# EAGLE design Combined board (EAGLE 9.5.0)
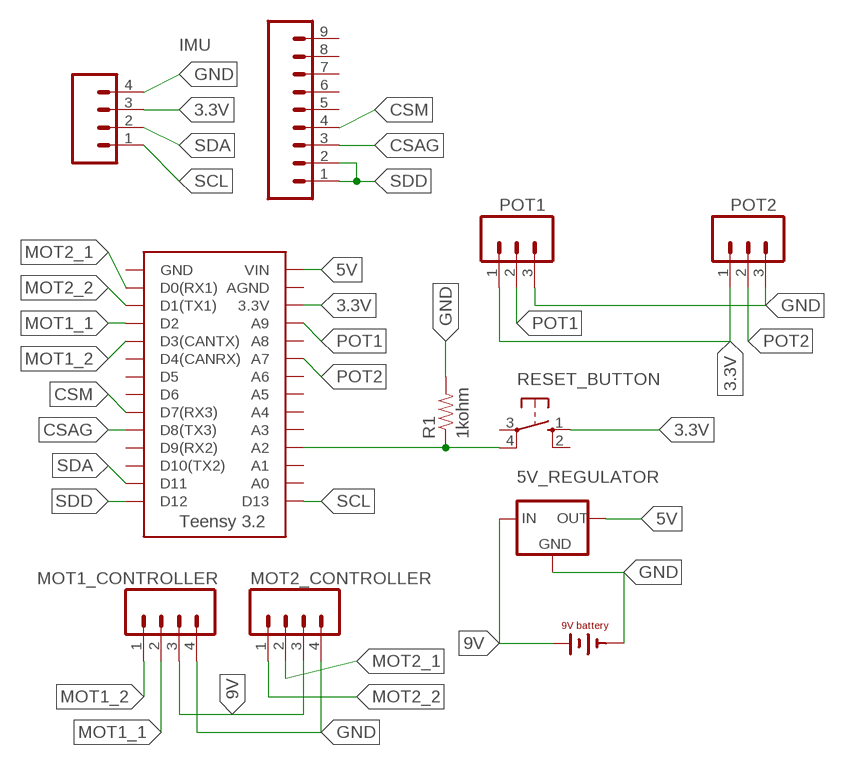
[diagram p0: schematic, sheet 1]

## Parts
5V_REGULATOR  OKI-78SR-5  [OKI-78SR]
G1  BAT9V  [AB9V]
IMU  M09  [1X09]
JP1  M04  [1X04]
MOT1_CONTROLLER  M04  [1X04]
MOT2_CONTROLLER  M04  [1X04]
POT1  M03  [1X03]
POT2  M03  [1X03]
R1  1kohm  RESISTORAXIAL-0.3  [AXIAL-0.3]
RESET_BUTTON  BTN_10-XX  [B3F-10XX]
U$2  TEENSY_3.2_SIMPLE  [TEENSY_3.2_SIMPLE]

## Nets
3.3V: JP1.3 POT1.1 POT2.1 RESET_BUTTON.1(S) U$2.3.3V
5V: 5V_REGULATOR.3(OUT) U$2.VIN
9V: 5V_REGULATOR.1(IN) G1.-(+) MOT1_CONTROLLER.3 MOT2_CONTROLLER.3
CSAG: IMU.3 U$2.D8(TX3)
CSM: IMU.4 U$2.D7(RX3)
GND: 5V_REGULATOR.2(GND) G1.+(-) JP1.4 MOT1_CONTROLLER.4 MOT2_CONTROLLER.4 POT1.3 POT2.3 R1.P$2
MOT1_1: MOT1_CONTROLLER.2 U$2.D2
MOT1_2: MOT1_CONTROLLER.1 U$2.D3(CANTX)
MOT2_1: MOT2_CONTROLLER.2 U$2.D0(RX1)
MOT2_2: MOT2_CONTROLLER.1 U$2.D1(TX1)
N$1: R1.P$1 RESET_BUTTON.4(P1) U$2.A2
POT1: POT1.2 U$2.A9
POT2: POT2.2 U$2.A7
SCL: JP1.1 U$2.D13
SDA: JP1.2 U$2.D11
SDD: IMU.1 IMU.2 U$2.D12
Unconnected: IMU.5 IMU.6 IMU.7 IMU.8 IMU.9 RESET_BUTTON.2(S1) RESET_BUTTON.3(P) U$2.A0 U$2.A1 U$2.A3 U$2.A4 U$2.A5 U$2.A6 U$2.A8 U$2.AGND U$2.D4(CANRX) U$2.D5 U$2.D6 U$2.D9(RX2) U$2.D10(TX2) U$2.GND

## Library data of the parts
5V_REGULATOR = HyTechDevices:OKI-78SR-5: Murata OKI-78SR 5V 1.5A Non-Isolated Switching Regulator DC/DC - Datasheet <https://power.murata.com/data/power/oki-78sr.pdf>
G1 = tango:BAT9V: 9-V BATTERY CLIP
IMU = HyTechDevices:M09: Standard 9-pin 0.1" header. Source: Sparkfun <https://github.com/sparkfun/SparkFun-Eagle-Libraries>
JP1 MOT1_CONTROLLER MOT2_CONTROLLER = HyTechDevices:M04: Standard 4-pin 0.1" header. NOTES ON THE VARIANTS LOCK and LOCK_LONGPADS... This footprint was designed to help hold the alignment of a through-hole component (i.e. 6-pin header) while soldering it into place. You may notice that each hole has been shifted either up or down by 0.005 of an inch from it's more standard position (which is a perfectly straight line). This slight alteration caused the pins (the squares in the middle) to touch the edges of the holes. Because they are alternating, it causes a "brace" to hold the component in place. 0.005 has proven to be the perfect amount of "off-center" position when using our standard breakaway headers. Although looks a little odd when you look at the bare footprint, once you have a header in there, the alteration is very hard to notice. Also,if you push a header all the way into place, it is covered up entirely on the bottom side. This idea of altering the position of holes to aid alignment will be further integrated into the Sparkfun Library for other footprints. It can help hold any component with 3 or more connection pins. Note: The Sparkfun version includes many other packages including surface mount that may be of future interest. Source: Sparkfun <https://github.com/sparkfun/SparkFun-Eagle-Libraries>
POT1 POT2 = HyTechDevices:M03: Standard 3-pin 0.1" header.
R1 = HyTechDevices:RESISTOR: Resistor Basic schematic elements and footprints for 0603, 1206, and PTH resistors.
RESET_BUTTON = HyTechDevices:BTN_10-XX: Small momentary tactile push button; MPN: B3F-1000; OC_FARNELL: 176432; OC_NEWARK: 36M3542
U$2 = HyTechDevices:TEENSY_3.2_SIMPLE: Simple version of the Teensy 3.2 board that only uses the 2 main rows of pins, not the inner pins or the pins opposite the usb port.

## Board
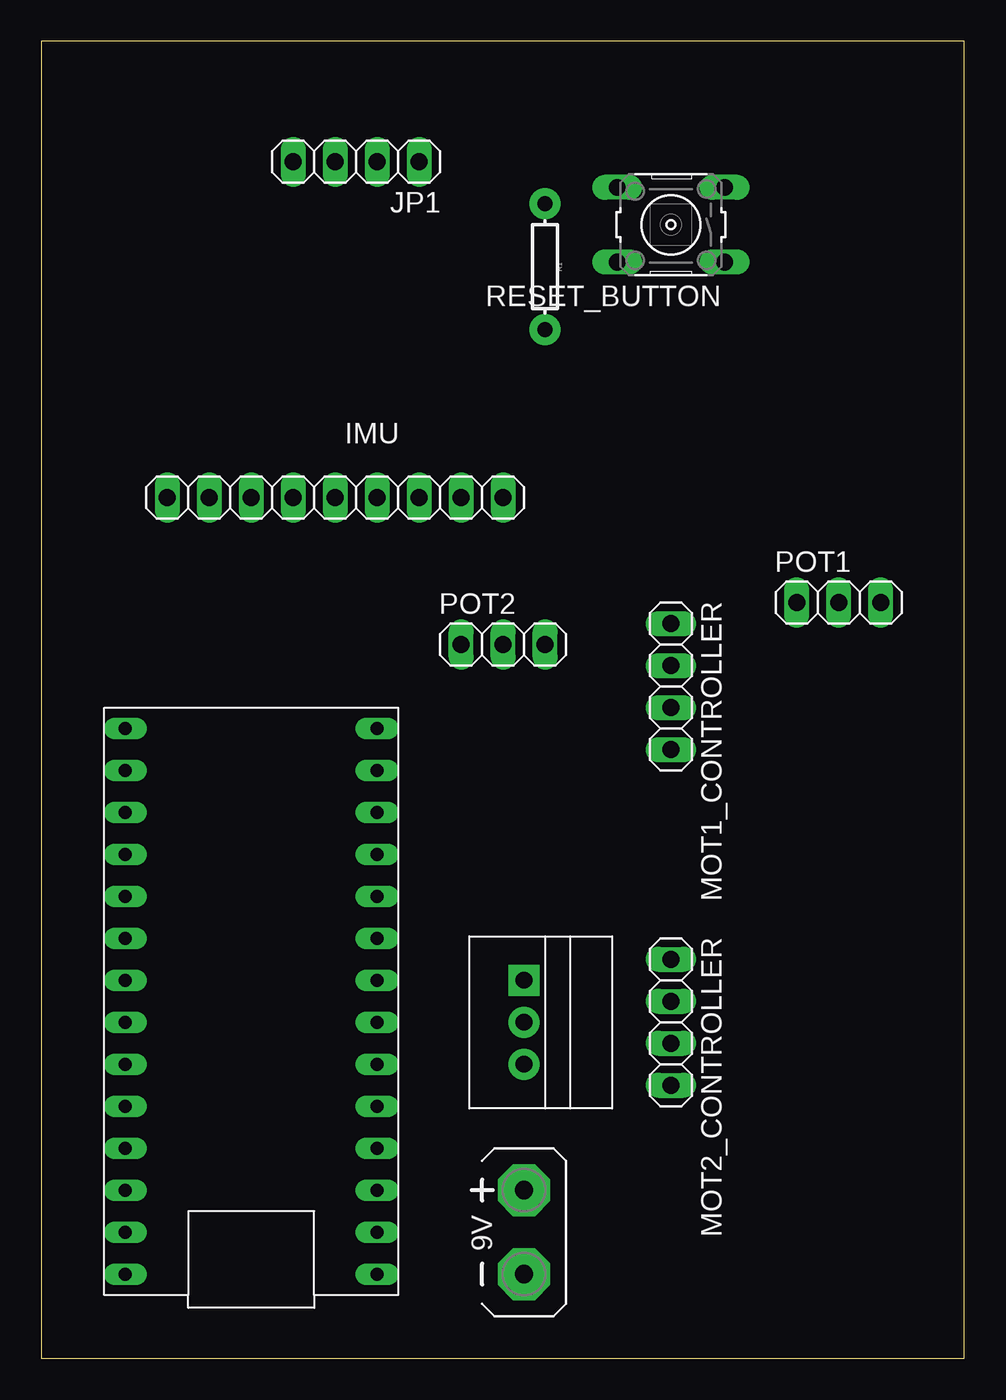
[diagram p1: board, top side]
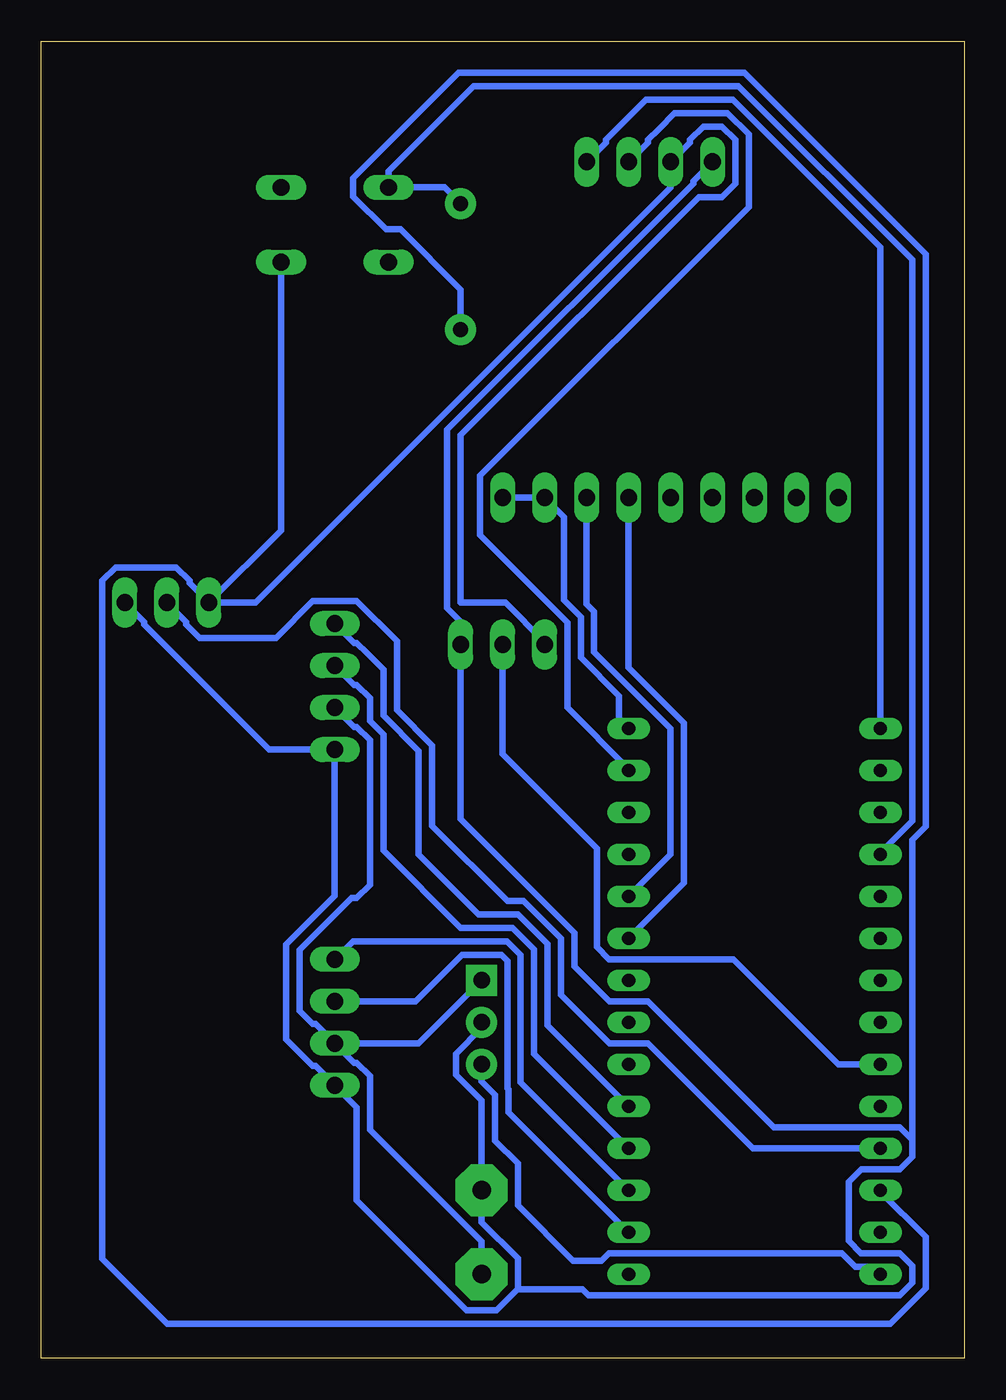
[diagram p2: board, bottom side, seen from below]

Size 55.86 x 79.68 mm. Coordinates in mm from the lower left corner, seen from the top.
Outline: 0,0 55.86,0 55.86,79.68 0,79.68 0,0
Copper layers (1*16): Top 0.035mm / dielectric 1.5mm / Bottom 0.035mm
Design rules "default *": minimum track width 6mil, minimum drill 0.35mm, track to track 16mil, track to pad 16mil, pad to pad 16mil, via to via 16mil, smd to smd 16mil, copper to edge 40mil, drill to drill 6mil, minimum pad ring 10mil, minimum via ring 8mil, stop-mask expansion 4mil, vias tented up to drill 0mil, thermal gap 10mil

### Footprints (pad centres in the part's own frame; a part is rotated, then mirrored left to right if it is on the bottom)
OKI-78SR = drill 1 pad 1.88 square: 1 -2.54,0 | drill 1 pad 1.88: 2 0,0; 3 2.54,0
AB9V = drill 1.118 pad 3.15 octagon: + 0,2.54; - 0,-2.54
1X09 = drill 1.016 long: 1 -8.89,0; 2 -6.35,0; 3 -3.81,0; 4 -1.27,0; 5 1.27,0; 6 3.81,0; 7 6.35,0; 8 8.89,0; 9 11.43,0
1X04 = drill 1.016 long: 1 -3.81,0; 2 -1.27,0; 3 1.27,0; 4 3.81,0
1X03 = drill 1.016 long: 1 -2.54,0; 2 0,0; 3 2.54,0
AXIAL-0.3 = drill 0.9 pad 1.88: P$1 -3.81,0; P$2 3.81,0
B3F-10XX = drill 1.016 long: 1 -3.251,2.261; 2 3.251,2.261; 3 -3.251,-2.261; 4 3.251,-2.261
TEENSY_3.2_SIMPLE = drill 0.8 long: 3.3V 16.51,29.21; A0 16.51,3.81; A1 16.51,6.35; A2 16.51,8.89; A3 16.51,11.43; A4 16.51,13.97; A5 16.51,16.51; A6 16.51,19.05; A7 16.51,21.59; A8 16.51,24.13; A9 16.51,26.67; AGND 16.51,31.75; D0(RX1) 1.27,31.75; D1(TX1) 1.27,29.21; D2 1.27,26.67; D3(CANTX) 1.27,24.13; D4(CANRX) 1.27,21.59; D5 1.27,19.05; D6 1.27,16.51; D7(RX3) 1.27,13.97; D8(TX3) 1.27,11.43; D9(RX2) 1.27,8.89; D10(TX2) 1.27,6.35; D11 1.27,3.81; D12 1.27,1.27; D13 16.51,1.27; GND 1.27,34.29; VIN 16.51,34.29

### Placement (x,y rotation side)
5V_REGULATOR  29.21,20.32 270 top
G1  29.21,7.62 0 top
IMU  19.05,52.07 180 top
JP1  19.05,72.39 180 top
MOT1_CONTROLLER  38.1,40.64 270 top
MOT2_CONTROLLER  38.1,20.32 270 top
POT1  48.26,45.72 0 top
POT2  27.94,43.18 0 top
R1  30.48,66.04 270 top
RESET_BUTTON  38.1,68.58 180 top
U$2  21.59,39.37 180 top

### Tracks (layer width: path | path; a pad name or v marks a point on that pad's centre or on a via)
3.3V
  Bottom 0.406: U$2.3.3V 5.08,10.06 2.35,7.33 2.35,4.22 4.49,2.08 48.23,2.08 52.17,6.02 52.17,47.05 51.37,47.85 47.69,47.85 46.89,47.05 46.89,46.89 POT1.1 | POT1.1 42.9,45.72 17.78,70.84 JP1.3 16.61,73.56 16.61,73.72 15.81,74.52 14.67,74.52 13.87,73.72 13.87,71.06 14.67,70.26 16.06,70.26 30.48,55.84 30.48,45.72 27.78,45.72 25.4,43.34 POT2.1 | RESET_BUTTON.1 41.35,50.09 POT1.1
5V
  Bottom 0.406: U$2.VIN 5.54,5.54 6.59,5.54 7.41,6.36 7.42,6.34 21.5,6.34 21.95,5.89 23.67,5.89 27.03,9.25 27.03,11.79 28.4,13.16 28.4,15.93 29.21,16.74 5V_REGULATOR.3
9V
  Bottom 0.406: MOT2_CONTROLLER.3 33.02,19.05 5V_REGULATOR.1 | MOT2_CONTROLLER.3 39.27,20.22 39.43,20.22 40.23,21.02 40.23,24.7 37.09,27.84 36.77,27.84 35.97,28.64 35.97,37.4 36.77,38.2 36.93,38.2 MOT1_CONTROLLER.3 | MOT2_CONTROLLER.3 36.93,17.88 36.77,17.88 35.97,17.08 35.97,13.83 29.21,7.07 G1.-
CSAG
  Bottom 0.406: IMU.3 22.86,45.64 22.4,45.18 22.4,42.72 17.78,38.1 17.78,30.48 U$2.D8(TX3)
CSM
  Bottom 0.406: IMU.4 20.32,41.79 16.97,38.44 16.97,28.75 U$2.D7(RX3)
GND
  Bottom 0.406: 5V_REGULATOR.2 29.21,19.97 30.76,18.42 30.76,17.14 29.21,15.59 G1.+ 29.21,8.22 27.03,6.04 27.03,4.17 | 27.03,4.17 28.3,2.9 30.12,2.9 36.78,9.56 36.78,15.19 MOT2_CONTROLLER.4 39.27,17.68 39.43,17.68 41.05,19.3 41.05,25.04 38.1,27.98 MOT1_CONTROLLER.4 42.07,36.83 49.63,44.39 49.63,44.55 POT1.3 | JP1.4 16.41,71.22 16.41,71.06 31.29,56.17 31.29,45.38 30.48,44.57 POT2.3 30.48,32.62 23.6,25.74 23.6,23.7 21.48,21.58 19.14,21.58 11.52,13.96 3.9,13.96 3.16,13.22 | 3.16,13.22 3.16,12.18 3.9,11.44 6.25,11.44 7,10.68 7,7.1 6.26,6.36 3.92,6.36 3.16,5.6 3.16,4.56 3.9,3.82 22.75,3.82 23.1,4.17 27.03,4.17 | 3.16,13.22 3.16,31.35 2.35,32.16 2.35,66.8 13.33,77.78 30.62,77.78 36.98,71.41 36.98,70.27 35.01,68.3 34.13,68.3 30.48,64.65 R1.P$2
MOT1_1
  Bottom 0.406: U$2.D2 26.04,18.41 26.04,24.73 27.34,26.04 30.48,26.04 35.15,30.71 35.15,37.73 35.97,38.55 35.97,39.94 36.77,40.74 36.93,40.74 MOT1_CONTROLLER.2
MOT1_2
  Bottom 0.406: U$2.D3(CANTX) 25.22,20.14 25.22,25.06 27.01,26.85 29.39,26.85 33.02,30.48 33.02,36.75 35.15,38.88 35.15,41.66 36.11,42.63 36.77,43.28 36.93,43.28 MOT1_CONTROLLER.1
MOT2_1
  Bottom 0.406: U$2.D0(RX1) 27.58,14.88 27.58,16.26 27.66,16.34 27.66,24.05 28.02,24.41 30.4,24.41 33.22,21.59 MOT2_CONTROLLER.2
MOT2_2
  Bottom 0.406: U$2.D1(TX1) 26.85,16.69 26.85,24.39 27.68,25.22 37.01,25.22 MOT2_CONTROLLER.1
N$1
  Bottom 0.406: U$2.A2 5.08,30.58 3.16,32.5 3.16,66.46 13.66,76.96 29.72,76.96 34.85,71.83 RESET_BUTTON.4 31.47,70.84 R1.P$1
POT1
  Bottom 0.406: U$2.A9 12.8,12.7 19.14,19.04 21.48,19.04 24.41,21.97 24.41,25.4 26.67,27.66 27.66,27.66 32.21,32.21 32.21,37.09 34.34,39.22 34.34,43.39 36.77,45.82 39.43,45.82 41.66,43.59 46.29,43.59 47.09,44.39 47.09,44.55 POT1.2
POT2
  Bottom 0.406: U$2.A7 7.62,17.78 13.98,24.14 21.5,24.14 22.24,24.88 22.24,30.84 27.45,36.05 27.94,36.55 POT2.2
SCL
  Bottom 0.406: JP1.1 21.69,73.56 21.69,73.72 19.26,76.15 14,76.15 5.08,67.23 U$2.D13
SDA
  Bottom 0.406: U$2.D11 20.32,35.66 24.03,39.37 24.03,44.51 29.31,49.79 29.31,53.4 13.06,69.66 13.06,74.06 14.34,75.34 17.54,75.34 18.5,74.38 19.15,73.72 19.15,73.56 JP1.2
SDD
  Bottom 0.406: IMU.1 IMU.2 24.23,50.9 24.23,45.86 23.22,44.85 23.22,42.39 20.9,40.06 20.9,38.67 U$2.D12